# Altium schematic sheet [03] - DAC8760.SchDoc
size A2
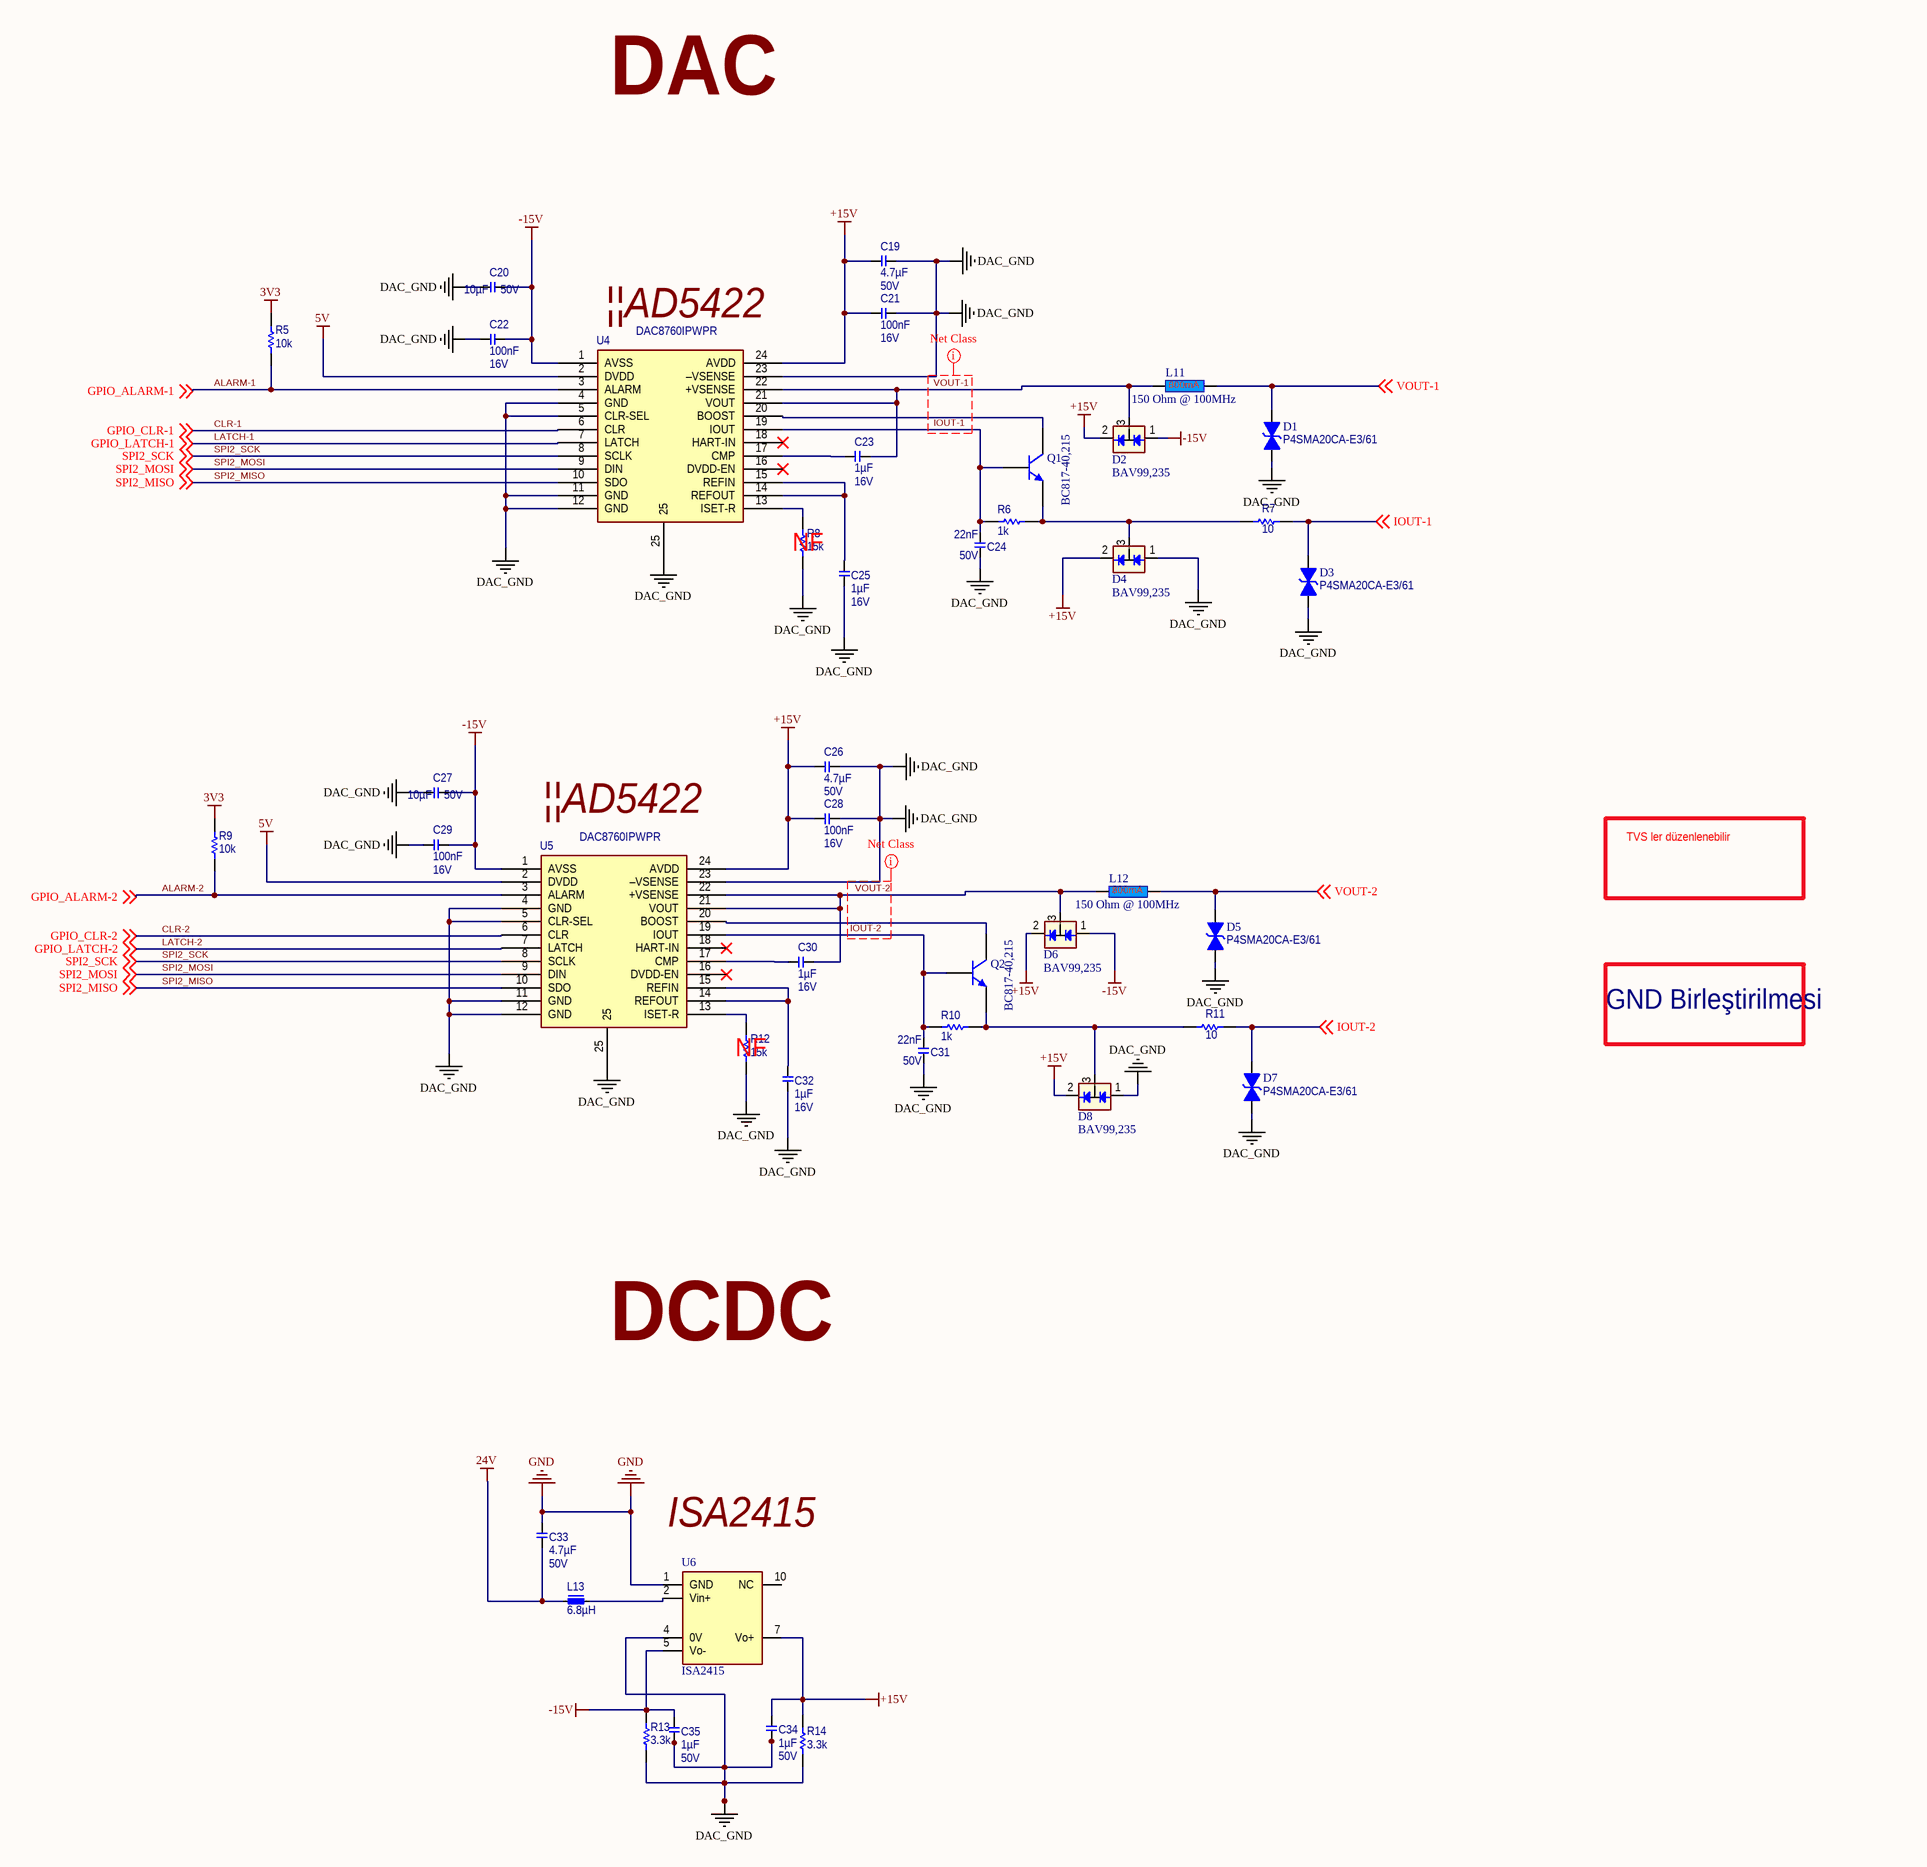
[diagram p0: [03] - DAC8760.SchDoc]

## Parts
C19  Capacitance: 4.7µF  Voltage - Rated: 50V  [C1206]  (hidden comment: 4.7UF 50V X7R)
C20  Capacitance: 10µF  Voltage - Rated: 50V  [C0805]  (hidden comment: 10UF 50V X5R)
C21  Voltage - Rated: 16V  [C0805]  (hidden comment: 100nF)
C22  Voltage - Rated: 16V  [C0805]  (hidden comment: 100nF)
C23  Voltage - Rated: 16V  [C0805]  (hidden comment: 1µF)
C24  Capacitance: 22nF  Voltage - Rated: 50V  [C0805]  (hidden comment: 22NF 50V X7R)
C25  Voltage - Rated: 16V  [C0805]  (hidden comment: 1µF)
C26  Capacitance: 4.7µF  Voltage - Rated: 50V  [C1206]  (hidden comment: 4.7UF 50V X7R)
C27  Capacitance: 10µF  Voltage - Rated: 50V  [C0805]  (hidden comment: 10UF 50V X5R)
C28  Voltage - Rated: 16V  [C0805]  (hidden comment: 100nF)
C29  Voltage - Rated: 16V  [C0805]  (hidden comment: 100nF)
C30  Voltage - Rated: 16V  [C0805]  (hidden comment: 1µF)
C31  Capacitance: 22nF  Voltage - Rated: 50V  [C0805]  (hidden comment: 22NF 50V X7R)
C32  Voltage - Rated: 16V  [C0805]  (hidden comment: 1µF)
C33  Capacitance: 4.7µF  Voltage - Rated: 50V  [C1206]  (hidden comment: 4.7UF 50V X7R)
C34  Capacitance: 1µF  Voltage - Rated: 50V  [C0805]  (hidden comment: 1UF 50V X7R)
C35  Capacitance: 1µF  Voltage - Rated: 50V  [C0805]  (hidden comment: 1UF 50V X7R)
D1  Manufacturer Part Number: P4SMA20CA-E3/61  [DO-214Ac]  (hidden comment: TVS DIODE 15VWM 24.4VC SMC)
D2  Manufacturer Part Number: BAV99,235  [SOT23-3 - Number]  (hidden comment: BAV99)
D3  Manufacturer Part Number: P4SMA20CA-E3/61  [DO-214Ac]  (hidden comment: TVS DIODE 15VWM 24.4VC SMC)
D4  Manufacturer Part Number: BAV99,235  [SOT23-3 - Number]  (hidden comment: BAV99)
D5  Manufacturer Part Number: P4SMA20CA-E3/61  [DO-214Ac]  (hidden comment: TVS DIODE 15VWM 24.4VC SMC)
D6  Manufacturer Part Number: BAV99,235  [SOT23-3 - Number]  (hidden comment: BAV99)
D7  Manufacturer Part Number: P4SMA20CA-E3/61  [DO-214Ac]  (hidden comment: TVS DIODE 15VWM 24.4VC SMC)
D8  Manufacturer Part Number: BAV99,235  [SOT23-3 - Number]  (hidden comment: BAV99)
L11  150 Ohm @ 100MHz  [0805]
L12  150 Ohm @ 100MHz  [0805]
L13  Inductance: 6.8µH  [0805]  (hidden comment: 6.8UH 550MA)
Q1  BC817-40,215  [SO-G3/Y1]
Q2  BC817-40,215  [SO-G3/Y1]
R5  Resistance (Ohms): 10k  [R0805]  (hidden comment: R-10K,%1,0805)
R6  Resistance (Ohms): 1k  [R0805]  (hidden comment: R-1K,0805)
R7  Resistance (Ohms): 10  [R0805]  (hidden comment: 10 OHM)
R8  Resistance (Ohms): 15k  [R0805]  (hidden comment: 15K OHM)
R9  Resistance (Ohms): 10k  [R0805]  (hidden comment: R-10K,%1,0805)
R10  Resistance (Ohms): 1k  [R0805]  (hidden comment: R-1K,0805)
R11  Resistance (Ohms): 10  [R0805]  (hidden comment: 10 OHM)
R12  Resistance (Ohms): 15k  [R0805]  (hidden comment: 15K OHM)
R13  Resistance (Ohms): 3.3k  [R0805]  (hidden comment: 3.3K OHM 0805)
R14  Resistance (Ohms): 3.3k  [R0805]  (hidden comment: 3.3K OHM 0805)
U4  Manufacturer Part Number: DAC8760IPWPR  [TSSOP-24]  (hidden comment: IC-DAC8760IPWPR)
U5  Manufacturer Part Number: DAC8760IPWPR  [TSSOP-24]  (hidden comment: IC-DAC8760IPWPR)
U6  DC/DC CONV  [ISA2415]  (value not drawn)

## Nets
3V3: R5.2 R9.2
5V: U4.2(DVDD) U5.2(DVDD)
24V: C33.1 L13.1
+15V: C19.1 C21.1 C26.1 C28.1 C34.2 D2.2(D-) D4.2(D-) D6.2(D-) D8.2(D-) R14.2 U4.24(AVDD) U5.24(AVDD) U6.7(Vo+)
-15V: C20.2 C22.2 C27.2 C29.2 C35.2 D2.1(D+) D6.1(D+) R13.2 U4.1(AVSS) U5.1(AVSS) U6.5(Vo-)
DAC_GND: C19.2 C20.1 C21.2 C22.1 C24.1 C25.1 C26.2 C27.1 C28.2 C29.1 C31.1 C32.1 C34.1 C35.1 D1.2(ANODE) D3.2(ANODE) D4.1(D+) D5.2(ANODE) D7.2(ANODE) D8.1(D+) R8.1 R12.1 R13.1 R14.1 U4.4(GND) U4.5(CLR-SEL) U4.11(GND) U4.12(GND) U4.23(–VSENSE) U4.25 U5.4(GND) U5.5(CLR-SEL) U5.11(GND) U5.12(GND) U5.23(–VSENSE) U5.25 U6.4(0V)
GND: C33.2 U6.1(GND)
ALARM-1: R5.1 U4.3(ALARM) ; off-sheet GPIO_ALARM-1  [also labelled GPIO_ALARM-1]
ALARM-2: R9.1 U5.3(ALARM) ; off-sheet GPIO_ALARM-2  [also labelled GPIO_ALARM-2]
CLR-1: U4.6(CLR) ; off-sheet GPIO_CLR-1  [also labelled GPIO_CLR-1]
CLR-2: U5.6(CLR) ; off-sheet GPIO_CLR-2  [also labelled GPIO_CLR-2]
IOUT-1: C24.2 D3.1(CATHODE) Q1.1(B) R6.1 R7.2 U4.19(IOUT) ; off-sheet IOUT-1
IOUT-2: C31.2 D7.1(CATHODE) Q2.1(B) R10.1 R11.2 U5.19(IOUT) ; off-sheet IOUT-2
LATCH-1: U4.7(LATCH) ; off-sheet GPIO_LATCH-1  [also labelled GPIO_LATCH-1]
LATCH-2: U5.7(LATCH) ; off-sheet GPIO_LATCH-2  [also labelled GPIO_LATCH-2]
SPI2_MISO: U4.10(SDO) U5.10(SDO) ; off-sheet SPI2_MISO
SPI2_MOSI: U4.9(DIN) U5.9(DIN) ; off-sheet SPI2_MOSI
SPI2_SCK: U4.8(SCLK) U5.8(SCLK) ; off-sheet SPI2_SCK
VOUT-1: C23.2 D1.1(CATHODE) D2.3 L11.1 L11.2 U4.21(VOUT) U4.22(+VSENSE) ; off-sheet VOUT-1
VOUT-2: C30.2 D5.1(CATHODE) D6.3 L12.1 L12.2 U5.21(VOUT) U5.22(+VSENSE) ; off-sheet VOUT-2
NetC23_1: C23.1 U4.17(CMP)
NetC25_2: C25.2 U4.14(REFOUT) U4.15(REFIN)
NetC30_1: C30.1 U5.17(CMP)
NetC32_2: C32.2 U5.14(REFOUT) U5.15(REFIN)
NetD4_3: D4.3 Q1.2(E) R6.2 R7.1
NetD8_3: D8.3 Q2.2(E) R10.2 R11.1
NetL13_2: L13.2 U6.2(Vin+)
NetQ1_3: Q1.3(C) U4.20(BOOST)
NetQ2_3: Q2.3(C) U5.20(BOOST)
NetR8_2: R8.2 U4.13(ISET-R)
NetR12_2: R12.2 U5.13(ISET-R)

Not connected (* = marked no-connect by the designer): U4 16(DVDD-EN)* 18(HART-IN)*; U5 16(DVDD-EN)* 18(HART-IN)*; U6 10(NC)

## Layout directives
net class DAC_OUT: IOUT-1, IOUT-2, VOUT-1, VOUT-2

## Notes on the sheet
- DAC
- (near U4) ||AD5422
- (near R8) NF
- (near U5) ||AD5422
- TVS ler düzenlenebilir
- GND Birleştirilmesi
- (near R12) NF
- DCDC
- (near U6) ISA2415

## Library data of the parts
C19 C26 C33 = C-4.7UF,50V,1206: CAP CER 4.7UF 50V X7R 1206; Manufacturer: Samsung Electro-Mechanics America, Inc.; Manufacturer Part Number: CL31B475KBHNNNE; Tolerance: ±10%; Supplier 1: Digi-Key; RoHS: RoHS Compliant; Category: Capacitors; Stock 1: 128633; Pricing 1: 1=0.34, 10=0.28, 25=0.1928, 50=0.1576, 100=0.1401, 500=0.0928, 1000=0.0823 (USD); Packaging: Digi-Reel®; Temperature Coefficient: X7R; Mounting Type: Surface Mount, MLCC; Operating Temperature: -55°C ~ 125°C; Applications: General Purpose; Ratings: -; Package / Case: 1206 (3216 Metric); Size / Dimension: 0.126" L x 0.063" W (3.20mm x 1.60mm); Height - Seated (Max): -; Thickness (Max): 0.071" (1.80mm); Lead Spacing: -; Features: -; Lead Style: -; ComponentLink1URL: http://www.samsungsem.com/kr/support/product-search/mlcc/CL31B475KBHNNNE.jsp; ComponentLink1Description: http://www.samsungsem.com/kr/support/product-search/mlcc/CL31B475KBHNNNE.jsp; Supplier Part Number 1: 1276-2789-6-ND
C20 C27 = C-10UF,50V,0805: CAP CER 10UF 50V X7R 1206; Manufacturer: Samsung Electro-Mechanics America, Inc.; Manufacturer Part Number: CL31B106KBHNNNE; Tolerance: ±10%; Supplier 1: Digi-Key; RoHS: RoHS Compliant; Category: Capacitors; Stock 1: 0; Pricing 1: 1=0.33, 10=0.29, 50=0.176, 100=0.1449, 500=0.1056, 1000=0.09524 (USD); Packaging: Cut Tape (CT); Temperature Coefficient: X7R; Mounting Type: Surface Mount, MLCC; Operating Temperature: -55°C ~ 125°C; Applications: General Purpose; Ratings: -; Package / Case: 1206 (3216 Metric); Size / Dimension: 0.126" L x 0.063" W (3.20mm x 1.60mm); Height - Seated (Max): -; Thickness (Max): 0.071" (1.80mm); Lead Spacing: -; Features: -; Lead Style: -; ComponentLink1URL: http://media.digikey.com/pdf/Data%20Sheets/Samsung%20PDFs/CL_Series_MLCC_ds.pdf; ComponentLink1Description: http://media.digikey.com/pdf/Data%20Sheets/Samsung%20PDFs/CL_Series_MLCC_ds.pdf; Supplier Part Number 1: 1276-6767-1-ND
C21 C22 C28 C29 = C-100NF,16V,0805: AVX - 0805YA103JAT2A - CAP, MLCC, C0G/NP0, 10NF, 16V, 0805; Tolerance: ±5%; Temperature Coefficient: C0G, NP0; Manufacturer: AVX; Manufacturer Part Number: 0805YA103JAT2A; RoHS: YES; ComponentLink1URL: http://www.avx.com/docs/Catalogs/ccog.pdf; ComponentLink1Description: http://www.avx.com/docs/Catalogs/ccog.pdf; ComponentLink2URL: http://www.farnell.com/datasheets/1825494.pdf; ComponentLink2Description: http://www.farnell.com/datasheets/1825494.pdf; Supplier 1: Digi-Key; Category: Capacitors; Stock 1: 28062; Pricing 1: 1=0.29, 10=0.204, 25=0.1668, 50=0.1424, 100=0.1221, 250=0.10176, 500=0.09158, 1000=0.07733 (USD); Packaging: Cut Tape (CT); Mounting Type: Surface Mount, MLCC; Operating Temperature: -55°C ~ 125°C; Applications: General Purpose; Ratings: -; Package / Case: 0805 (2012 Metric); Size / Dimension: 0.079" L x 0.049" W (2.01mm x 1.25mm); Height - Seated (Max): -; Thickness (Max): 0.037" (0.94mm); Lead Spacing: -; Features: -; Lead Style: -; ComponentLink3URL: http://datasheets.avx.com/C0GNP0-Dielectric.pdf; ComponentLink3Description: http://datasheets.avx.com/C0GNP0-Dielectric.pdf; Supplier Part Number 1: 478-1334-1-ND; Capacitance: 100nF
C23 C25 C30 C32 = C-1UF,16V,0805: AVX - 0805YC105KAT2A - CAP, MLCC, X7R, 1UF, 16V, 0805; Manufacturer: AVX Corporation; Tolerance: ±10%; Supplier 1: Digi-Key; Manufacturer Part Number: 0805YC105KAT2A; RoHS: RoHS Compliant; Category: Capacitors; Stock 1: 76930; Pricing 1: 1=0.19, 10=0.132, 25=0.0964, 50=0.075, 100=0.0622, 250=0.05148, 500=0.04362, 1000=0.03611 (USD); Packaging: Cut Tape (CT); Temperature Coefficient: X7R; Mounting Type: Surface Mount, MLCC; Operating Temperature: -55°C ~ 125°C; Applications: General Purpose; Ratings: -; Package / Case: 0805 (2012 Metric); Size / Dimension: 0.079" L x 0.049" W (2.01mm x 1.25mm); Height - Seated (Max): -; Thickness (Max): 0.055" (1.40mm); Lead Spacing: -; Features: -; Lead Style: -; ComponentLink1URL: http://datasheets.avx.com/X7RDielectric.pdf; ComponentLink1Description: http://datasheets.avx.com/X7RDielectric.pdf; Supplier Part Number 1: 478-5034-1-ND; Capacitance: 1µF
C24 C31 = C-22NF,50V: CAP CER 0.022UF 50V X7R 0805; Manufacturer: Kemet; Manufacturer Part Number: C0805C223K5RACTU; Tolerance: ±10%; Supplier 1: Digi-Key; RoHS: RoHS Compliant; Category: Capacitors; Stock 1: 126853; Pricing 1: 1=0.1, 10=0.064, 50=0.0344, 100=0.0292, 250=0.02384, 500=0.0204, 1000=0.0159 (USD); Packaging: Cut Tape (CT); Temperature Coefficient: X7R; Mounting Type: Surface Mount, MLCC; Operating Temperature: -55°C ~ 125°C; Applications: General Purpose; Ratings: -; Package / Case: 0805 (2012 Metric); Size / Dimension: 0.079" L x 0.049" W (2.00mm x 1.25mm); Height - Seated (Max): -; Thickness (Max): 0.035" (0.88mm); Lead Spacing: -; Features: Low ESL; Lead Style: -; ComponentLink1URL: http://www.kemet.com/docfinder?Partnumber=C0805C223K5RACTU; ComponentLink1Description: http://www.kemet.com/docfinder?Partnumber=C0805C223K5RACTU; Supplier Part Number 1: 399-1163-1-ND
C34 C35 = C-1UF,50V: CAP CER 1UF 50V X7R 0805; Manufacturer: Samsung Electro-Mechanics America, Inc.; Manufacturer Part Number: CL21B105KBFNNNE; Tolerance: ±10%; Supplier 1: Digi-Key; RoHS: RoHS Compliant; Category: Capacitors; Stock 1: 162738; Pricing 1: 1=0.21, 10=0.143, 25=0.104, 50=0.0866, 100=0.0727, 500=0.05194, 1000=0.04414 (USD); Packaging: Digi-Reel®; Temperature Coefficient: X7R; Mounting Type: Surface Mount, MLCC; Operating Temperature: -55°C ~ 125°C; Applications: General Purpose; Ratings: -; Package / Case: 0805 (2012 Metric); Size / Dimension: 0.079" L x 0.049" W (2.00mm x 1.25mm); Height - Seated (Max): -; Thickness (Max): 0.053" (1.35mm); Lead Spacing: -; Features: -; Lead Style: -; ComponentLink1URL: http://www.samsungsem.com/kr/support/product-search/mlcc/CL21B105KBFNNNE.jsp; ComponentLink1Description: http://www.samsungsem.com/kr/support/product-search/mlcc/CL21B105KBFNNNE.jsp; Supplier Part Number 1: 1276-1029-6-ND
D1 D3 D5 D7 = D-P4SMA20CA TVS DIODE: TVS DIODE 17.1VWM 27.7VC SMA; Manufacturer: Vishay Semiconductor Diodes Division; Type: Zener; Bidirectional Channels: 1; Voltage - Reverse Standoff (Typ): 17.1V; Voltage - Breakdown (Min): 19V; Voltage - Clamping (Max) @ Ipp: 27.7V; Current - Peak Pulse (10/1000µs): 14.4A; Power - Peak Pulse: 400W; Power Line Protection: No; Supplier 1: Digi-Key; RoHS: RoHS Compliant; Category: Circuit Protection; Stock 1: 729; Pricing 1: 1=0.36, 10=0.29, 25=0.2656, 100=0.1978, 250=0.17924, 500=0.14832 (USD); Packaging: Digi-Reel®; Part Status: Active; Unidirectional Channels: -; Applications: General Purpose; Capacitance @ Frequency: -; Operating Temperature: -65°C ~ 150°C (TJ); Mounting Type: Surface Mount; Package / Case: DO-214AC, SMA; Supplier Device Package: DO-214AC (SMA); ComponentLink1URL: http://www.vishay.com/docs/88367/p4sma.pdf; ComponentLink1Description: http://www.vishay.com/docs/88367/p4sma.pdf; Supplier Part Number 1: P4SMA20CA-E3/61GIDKR-ND
D2 D4 D6 D8 = D-BAV99,235: DIODE ARRAY GP 100V 215MA SOT23; Manufacturer: NXP Semiconductors; Diode Configuration: 1 Pair Series Connection; Diode Type: Standard; Current - Average Rectified (Io) (per Diode): 215mA (DC); Voltage - Forward (Vf) (Max) @ If: 1.25V @ 150mA; Speed: Fast Recovery =< 500ns, > 200mA (Io); Reverse Recovery Time (trr): 4ns; Current - Reverse Leakage @ Vr: 500nA @ 80V; Supplier 1: Digi-Key; RoHS: RoHS Compliant; Category: Discrete Semiconductor Products; Stock 1: 40000; Pricing 1: 10000=0.017, 30000=0.0153, 50000=0.0136, 100000=0.01275, 250000=0.01131 (USD); Packaging: Tape & Reel (TR); Voltage - DC Reverse (Vr) (Max): 100V; Mounting Type: Surface Mount; Package / Case: TO-236-3, SC-59, SOT-23-3; Supplier Device Package: SOT-23 (TO-236AB); ComponentLink1URL: http://www.nxp.com/documents/data_sheet/BAV99_SER.pdf; ComponentLink1Description: http://www.nxp.com/documents/data_sheet/BAV99_SER.pdf; Supplier Part Number 1: 568-5005-2-ND
L11 L12 = L-150OHM,800MA: FERRITE 800MA 150 OHM 0805 SMD; Manufacturer: Laird-Signal Integrity Products; Manufacturer Part Number: LI0805H151R-10; DC Resistance (DCR): 150 mOhm Max; Filter Type: Differential Mode - Single; Supplier 1: Digi-Key; RoHS: RoHS Compliant; Category: Filters; Stock 1: 418596; Pricing 1: 1=0.1, 10=0.07, 25=0.064, 50=0.0574, 100=0.0421, 250=0.03064, 500=0.02808, 1000=0.02424 (USD); Packaging: Cut Tape (CT); Current Rating: 800mA; Package / Case: 0805 (2012 Metric); Mounting Type: Surface Mount; Height (Max): 0.043" (1.10mm); Size / Dimension: 0.079" L x 0.049" W (2.00mm x 1.25mm); ComponentLink1URL: http://www.lairdtech.com/WorkArea/linkit.aspx?LinkIdentifier=id&ItemID=4912; ComponentLink1Description: http://www.lairdtech.com/WorkArea/linkit.aspx?LinkIdentifier=id&ItemID=4912; Supplier Part Number 1: 240-2384-1-ND; Impedance @ Frequency: 150 Ohm @ 100MHz
L13 = L-6.8UH,550mA,0805: FIXED IND 6.8UH 550MA 250 MOHM; Manufacturer: TDK Corporation; Manufacturer Part Number: MLZ2012N6R8LT000; Type: Multilayer; Material - Core: Ferrite; Tolerance: ±20%; Current - Saturation: 110mA; Shielding: Shielded; Frequency - Self Resonant: 60MHz; Frequency - Test: 2MHz; Supplier 1: Digi-Key; RoHS: RoHS Compliant; Category: Inductors, Coils, Chokes; Stock 1: 11951; Pricing 1: 1=0.14, 10=0.125, 50=0.0976, 100=0.0875, 500=0.075, 1000=0.065 (USD); Packaging: Digi-Reel®; Part Status: Active; Current Rating: 550mA; DC Resistance (DCR): 250 mOhm; Q @ Freq: -; Ratings: -; Operating Temperature: -55°C ~ 125°C; Mounting Type: Surface Mount; Package / Case: 0805 (2012 Metric); Size / Dimension: 0.079" L x 0.049" W (2.00mm x 1.25mm); Height - Seated (Max): 0.057" (1.45mm); ComponentLink1URL: https://product.tdk.com/info/en/catalog/datasheets/inductor_commercial_decoupling_mlz2012_en.pdf; ComponentLink1Description: https://product.tdk.com/info/en/catalog/datasheets/inductor_commercial_decoupling_mlz2012_en.pdf; Supplier Part Number 1: 445-6761-6-ND
Q1 Q2 = T-BC817-40 NPN: TRANS NPN 45V 0.5A SOT23; Manufacturer: NXP Semiconductors; Current - Collector (Ic) (Max): 500mA; Vce Saturation (Max) @ Ib, Ic: 700mV @ 50mA, 500mA; Current - Collector Cutoff (Max): 100nA (ICBO); DC Current Gain (hFE) (Min) @ Ic, Vce: 250 @ 100mA, 1V; Power - Max: 250mW; Frequency - Transition: 100MHz; Supplier 1: Digi-Key; RoHS: RoHS Compliant; Category: Discrete Semiconductor Products; Stock 1: 130982; Pricing 1: 1=0.14, 10=0.127, 100=0.0693, 500=0.04258, 1000=0.02905 (USD); Packaging: Cut Tape (CT); Transistor Type: NPN; Voltage - Collector Emitter Breakdown (Max): 45V; Mounting Type: Surface Mount; Package / Case: TO-236-3, SC-59, SOT-23-3; Supplier Device Package: SOT-23 (TO-236AB); ComponentLink1URL: http://www.nxp.com/documents/data_sheet/BC817_BC817W_BC337.pdf; ComponentLink1Description: http://www.nxp.com/documents/data_sheet/BC817_BC817W_BC337.pdf; Supplier Part Number 1: 568-1631-1-ND; Manufacturer Part Number: BC817-40,215
R5 R9 = R-10K,%1,0805: RES SMD 10K OHM 1% 1/8W 0805; Manufacturer: Yageo; Manufacturer Part Number: RC0805FR-0710KL; Power (Watts): 0.125W, 1/8W; Temperature Coefficient: ±100ppm/°C; Supplier 1: Digi-Key; RoHS: RoHS Compliant; Category: Resistors; Stock 1: 4020575; Pricing 1: 1=0.1, 10=0.021, 25=0.0152, 100=0.0084, 250=0.00644, 500=0.00514, 1000=0.00379, 2500=0.00329 (USD); Packaging: Cut Tape (CT); Tolerance: ±1%; Composition: Thick Film; Features: Moisture Resistant; Operating Temperature: -55°C ~ 155°C; Package / Case: 0805 (2012 Metric); Supplier Device Package: 0805; Size / Dimension: 0.079" L x 0.049" W (2.00mm x 1.25mm); Height: 0.024" (0.60mm); Number of Terminations: 2; ComponentLink1URL: http://www.yageo.com/documents/recent/PYu-RC_Group_51_RoHS_L_04.pdf; ComponentLink1Description: http://www.yageo.com/documents/recent/PYu-RC_Group_51_RoHS_L_04.pdf; Supplier Part Number 1: 311-10.0KCRCT-ND
R6 R10 = R-1K,0805: BOURNS - CR0805-FX-1001ELF - RESISTOR, 1K, 0.125W, 1%; Manufacturer: Bourns Inc.; Power (Watts): 0.125W, 1/8W; Temperature Coefficient: ±100ppm/°C; Supplier 1: Digi-Key; Manufacturer Part Number: CR0805-FX-1001ELF; RoHS: RoHS Compliant; Category: Resistors; Stock 1: 68774; Pricing 1: 1=0.1, 10=0.069, 25=0.05, 50=0.038, 100=0.028, 250=0.0214, 500=0.0171, 1000=0.01259, 2500=0.01093 (USD); Packaging: Cut Tape (CT); Tolerance: ±1%; Composition: Thick Film; Features: Moisture Resistant; Operating Temperature: -55°C ~ 155°C; Package / Case: 0805 (2012 Metric); Supplier Device Package: 0805; Size / Dimension: 0.079" L x 0.049" W (2.00mm x 1.25mm); Height: 0.024" (0.60mm); Number of Terminations: 2; ComponentLink1URL: http://www.bourns.com/docs/Product-Datasheets/CHPREZTR.pdf; ComponentLink1Description: http://www.bourns.com/docs/Product-Datasheets/CHPREZTR.pdf; Supplier Part Number 1: CR0805-FX-1001ELFCT-ND
R7 R11 = R-10R,0805: RES SMD 10 OHM 1% 1/8W 0805; Manufacturer: Yageo; Manufacturer Part Number: RC0805FR-0710RL; Power (Watts): 0.125W, 1/8W; Temperature Coefficient: ±200ppm/°C; Supplier 1: Digi-Key; RoHS: RoHS Compliant; Category: Resistors; Stock 1: 702652; Pricing 1: 1=0.1, 10=0.021, 25=0.0152, 100=0.0084, 250=0.00644, 500=0.00514, 1000=0.00379, 2500=0.00329 (USD); Packaging: Digi-Reel®; Tolerance: ±1%; Composition: Thick Film; Features: Moisture Resistant; Operating Temperature: -55°C ~ 155°C; Package / Case: 0805 (2012 Metric); Supplier Device Package: 0805; Size / Dimension: 0.079" L x 0.049" W (2.00mm x 1.25mm); Height: 0.024" (0.60mm); Number of Terminations: 2; ComponentLink1URL: http://www.yageo.com/documents/recent/PYu-RC_Group_51_RoHS_L_04.pdf; ComponentLink1Description: http://www.yageo.com/documents/recent/PYu-RC_Group_51_RoHS_L_04.pdf; Supplier Part Number 1: 311-10.0CRDKR-ND
R8 R12 = R-15k,0805: RES SMD 15K OHM 5% 1/8W 0805; Manufacturer: Yageo; Manufacturer Part Number: RC0805JR-0715KL; Power (Watts): 0.125W, 1/8W; Temperature Coefficient: ±100ppm/°C; Supplier 1: Digi-Key; RoHS: RoHS Compliant; Category: Resistors; Stock 1: 97321; Pricing 1: 1=0.1, 10=0.018, 25=0.0128, 100=0.0073, 250=0.00556, 500=0.00444, 1000=0.00326, 2500=0.00283 (USD); Packaging: Cut Tape (CT); Tolerance: ±5%; Composition: Thick Film; Features: Moisture Resistant; Operating Temperature: -55°C ~ 155°C; Package / Case: 0805 (2012 Metric); Supplier Device Package: 0805; Size / Dimension: 0.079" L x 0.049" W (2.00mm x 1.25mm); Height: 0.024" (0.60mm); Number of Terminations: 2; ComponentLink1URL: http://www.yageo.com/documents/recent/PYu-RC_Group_51_RoHS_L_04.pdf; ComponentLink1Description: http://www.yageo.com/documents/recent/PYu-RC_Group_51_RoHS_L_04.pdf; Supplier Part Number 1: 311-15KARCT-ND
R13 R14 = R-3.3K,0805: RES SMD 3.3K OHM 5% 1/8W 0805; Manufacturer: Yageo; Manufacturer Part Number: RC0805JR-073K3L; Power (Watts): 0.125W, 1/8W; Temperature Coefficient: ±100ppm/°C; Supplier 1: Digi-Key; RoHS: RoHS Compliant; Category: Resistors; Stock 1: 439567; Pricing 1: 1=0.1, 10=0.018, 25=0.0128, 100=0.0073, 250=0.00556, 500=0.00444, 1000=0.00326, 2500=0.00283 (USD); Packaging: Digi-Reel®; Tolerance: ±5%; Composition: Thick Film; Features: Moisture Resistant; Operating Temperature: -55°C ~ 155°C; Package / Case: 0805 (2012 Metric); Supplier Device Package: 0805; Size / Dimension: 0.079" L x 0.049" W (2.00mm x 1.25mm); Height: 0.024" (0.60mm); Number of Terminations: 2; ComponentLink1URL: http://www.yageo.com/documents/recent/PYu-RC_Group_51_RoHS_L_04.pdf; ComponentLink1Description: http://www.yageo.com/documents/recent/PYu-RC_Group_51_RoHS_L_04.pdf; Supplier Part Number 1: 311-3.3KARDKR-ND
U4 U5 = IC-DAC8760IPWPR: IC DAC 1CH 16BIT PROGR 24HTSSOP; Manufacturer: Texas Instruments; Number of Bits: 16; Number of D/A Converters: 1; Settling Time: 25µs (Typ); Output Type: Voltage or Current - Buffered; Differential Output: No; Data Interface: SPI, DSP; Reference Type: External, Internal; Voltage - Supply, Analog: 10 V ~ 36 V, -18V; Voltage - Supply, Digital: 2.7 V ~ 5.5 V; INL/DNL (LSB): -, ±1 (Max); Architecture: String DAC; Supplier 1: Digi-Key; RoHS: RoHS Compliant; Category: Integrated Circuits (ICs); Stock 1: 386; Pricing 1: 1=8.8, 10=7.972, 100=6.5715, 500=5.7456, 1000=4.48875 (USD); Packaging: Cut Tape (CT); Operating Temperature: -40°C ~ 125°C; Package / Case: 24-TSSOP (0.173", 4.40mm Width) Exposed Pad; Supplier Device Package: 24-HTSSOP; ComponentLink1URL: http://www.ti.com/lit/ds/symlink/dac8760.pdf; ComponentLink1Description: http://www.ti.com/lit/ds/symlink/dac8760.pdf; Supplier Part Number 1: 296-37189-1-ND
U6 = IC-ISA2415: DC/DC CONV 1W SMD DUAL OUT; Manufacturer: XP Power; Number of Outputs: 2; Voltage - Input (Min): 21.6V; Voltage - Input (Max): 26.4V; Voltage - Output 1: 15V; Voltage - Output 2: -15V; Current - Output (Max): 33mA, 33mA; Voltage - Isolation: 1.5kV (1500V); Efficiency: 82%; Supplier 1: Digi-Key; RoHS: RoHS Compliant; Category: Power Supplies - Board Mount; Stock 1: 223; Pricing 1: 1=4.75, 5=4.61, 10=4.47, 25=4.28, 100=3.99, 500=3.71002 (USD); Packaging: Tube; Type: Isolated Module; Voltage - Output 3: -; Power (Watts) - Manufacture Series: 1W; Applications: ITE (Commercial); Features: SCP; Mounting Type: Surface Mount; Package / Case: 10-SMD Module (6 Leads); Size / Dimension: 0.60" L x 0.33" W x 0.29" H (15.2mm x 8.3mm x 7.3mm); Operating Temperature: -40°C ~ 105°C; Power (Watts) - Max: 1W; ComponentLink1URL: http://www.xppower.com/Portals/0/pdfs/SF_ISA.pdf; ComponentLink1Description: http://www.xppower.com/Portals/0/pdfs/SF_ISA.pdf; Supplier Part Number 1: 1470-2970-5-ND; Manufacturer Part Number: ISA2415